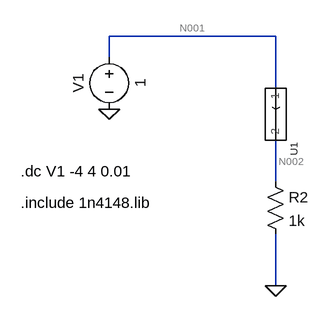
[diagram p0: schematic d_import.asc]
d_import.asc, the LTspice schematic file:
Version 4
SHEET 1 3460 908
WIRE 240 48 -16 48
WIRE -16 80 -16 48
WIRE 240 128 240 48
WIRE 240 272 240 208
WIRE 240 432 240 352
FLAG -16 160 0
FLAG 240 432 0
SYMBOL voltage -16 64 R0
WINDOW 0 -32 56 VBottom 2
WINDOW 3 32 56 VTop 2
WINDOW 123 0 0 Left 0
WINDOW 39 0 0 Left 0
SYMATTR InstName V1
SYMATTR Value 1
SYMBOL res 224 256 R0
SYMATTR InstName R2
SYMATTR Value 1k
SYMBOL TwoTerminal 240 128 R90
SYMATTR InstName U1
SYMATTR Value 1N4148
TEXT -152 256 Left 2 !.dc V1 -4 4 0.01
TEXT -152 304 Left 2 !.include 1n4148.lib

The netlist it stands for:
* d_import.asc
V1 N001 0 1
R2 N002 0 1k
XU1 N001 N002 1N4148  ; pins 1 2
.dc V1 -4 4 0.01
.include 1n4148.lib
.backanno
.end

* Results of the author's LTspice run, read from the files saved beside the schematic
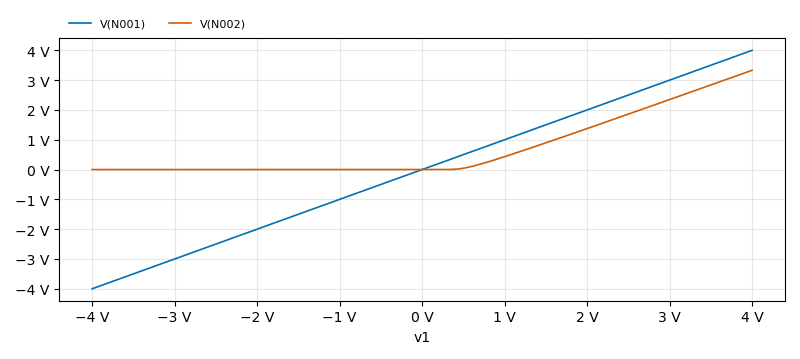
[diagram p1: DC transfer characteristic of d_import.asc, plotted from the saved traces]
* DC transfer characteristic, 1 run:
*   V(N001): -4 V at v1=-4 V, 4 V at v1=4 V, min -4 V, max 4 V
*   V(N002): -5.042 µV at v1=-4 V, 3.33 V at v1=4 V, min -5.042 µV, max 3.33 V